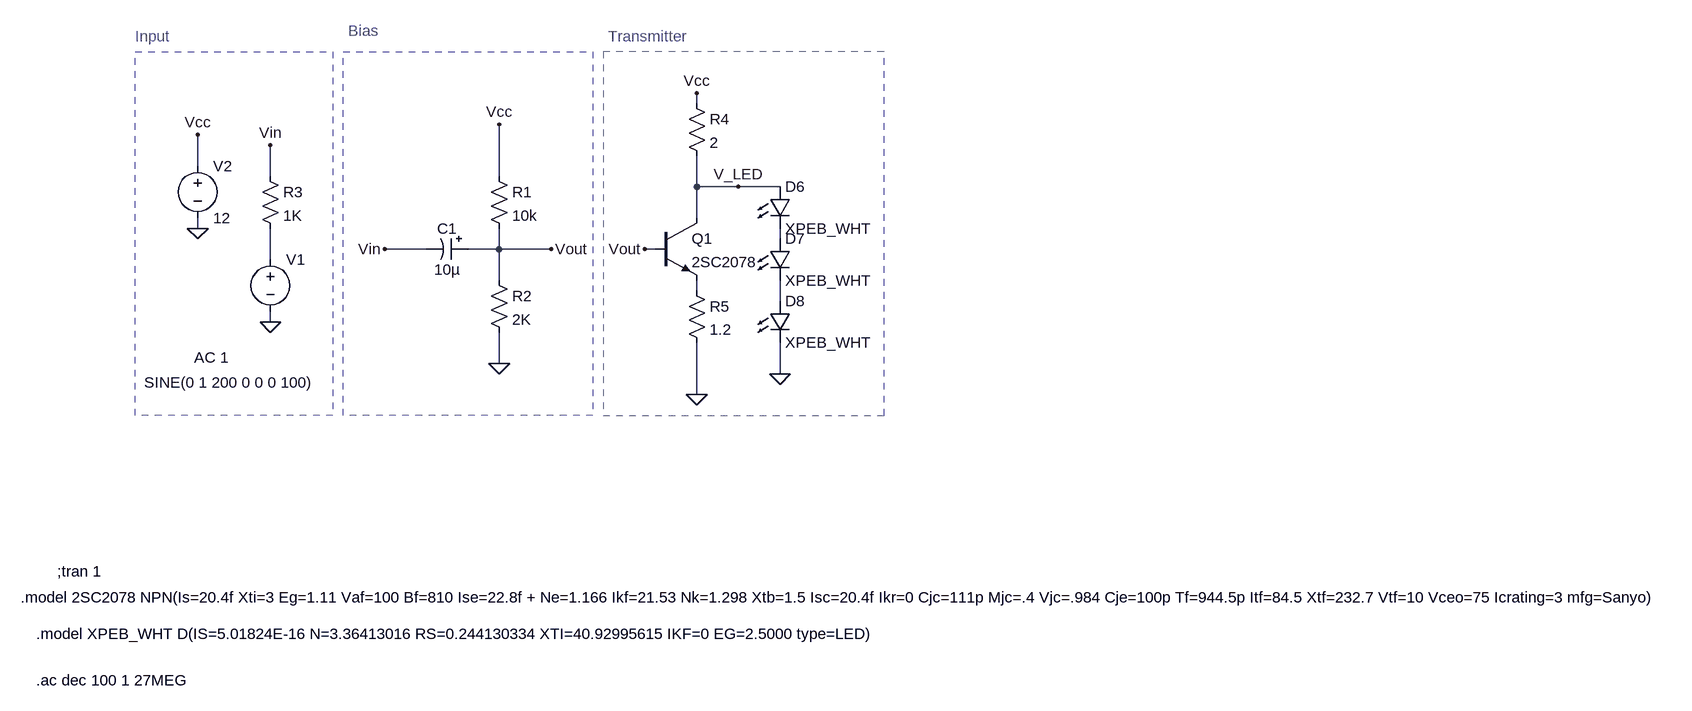
[diagram p0: schematic Transmitter Audio 2.asc]
Transmitter Audio 2.asc, the LTspice schematic file:
Version 4
SHEET 1 3692 824
WIRE 496 -80 496 -96
WIRE -272 16 -272 -32
WIRE -160 32 -160 -16
WIRE 192 32 192 -48
WIRE 496 48 496 0
WIRE 560 48 496 48
WIRE 624 48 560 48
WIRE 496 96 496 48
WIRE -272 112 -272 96
WIRE 624 128 624 112
WIRE 80 144 16 144
WIRE 192 144 192 112
WIRE 192 144 144 144
WIRE 272 144 192 144
WIRE 432 144 416 144
WIRE -160 160 -160 112
WIRE 192 192 192 144
WIRE 496 208 496 192
WIRE 624 224 624 192
WIRE -160 256 -160 240
WIRE 192 320 192 272
WIRE 624 336 624 288
WIRE 496 368 496 288
FLAG 16 144 Vin
FLAG 192 320 0
FLAG -160 256 0
FLAG -272 -32 Vcc
FLAG 192 -48 Vcc
FLAG 496 368 0
FLAG 496 -96 Vcc
FLAG -272 112 0
FLAG -160 -16 Vin
FLAG 416 144 Vout
FLAG 272 144 Vout
FLAG 624 336 0
FLAG 560 48 V_LED
DATAFLAG 192 176 ""
SYMBOL res 176 16 R0
SYMATTR InstName R1
SYMATTR Value 10k
SYMBOL res 176 176 R0
SYMATTR InstName R2
SYMATTR Value 2K
SYMBOL polcap 144 128 R90
WINDOW 0 0 32 VBottom 2
WINDOW 3 32 32 VTop 2
SYMATTR InstName C1
SYMATTR Value 10µ
SYMATTR Description Capacitor
SYMATTR Type cap
SYMATTR SpiceLine V=25 Irms=27m Rser=2.22517 Lser=834.91p mfg="Würth Elektronik" pn="865090440003 WCAP-ASLU 4x5,5" type="Al electrolytic"
SYMBOL voltage -160 144 R0
WINDOW 123 -117 167 Left 2
WINDOW 39 0 0 Left 0
WINDOW 3 -194 205 Left 2
SYMATTR Value2 AC 1
SYMATTR InstName V1
SYMATTR Value SINE(0 1 200 0 0 0 100)
SYMBOL LED 608 48 R0
SYMATTR InstName D6
SYMATTR Value XPEB_WHT
SYMBOL voltage -272 0 R0
WINDOW 123 0 0 Left 0
WINDOW 39 0 0 Left 0
SYMATTR InstName V2
SYMATTR Value 12
SYMBOL npn 432 96 R0
SYMATTR InstName Q1
SYMATTR Value 2SC2078
SYMBOL res 480 -96 R0
SYMATTR InstName R4
SYMATTR Value 2
SYMBOL res 480 192 R0
SYMATTR InstName R5
SYMATTR Value 1.2
SYMBOL LED 608 128 R0
SYMATTR InstName D7
SYMATTR Value XPEB_WHT
SYMBOL LED 608 224 R0
SYMATTR InstName D8
SYMATTR Value XPEB_WHT
SYMBOL res -176 16 R0
SYMATTR InstName R3
SYMATTR Value 1K
TEXT -40 -192 Left 2 ;Bias
TEXT 360 -184 Left 2 ;Transmitter
TEXT -368 -184 Left 2 ;Input
TEXT -520 736 Left 2 !.model XPEB_WHT D(IS=5.01824E-16 N=3.36413016 RS=0.244130334 XTI=40.92995615 IKF=0 EG=2.5000 type=LED)
TEXT -544 680 Left 2 !.model 2SC2078 NPN(Is=20.4f Xti=3 Eg=1.11 Vaf=100 Bf=810 Ise=22.8f + Ne=1.166 Ikf=21.53 Nk=1.298 Xtb=1.5 Isc=20.4f Ikr=0 Cjc=111p Mjc=.4 Vjc=.984 Cje=100p Tf=944.5p Itf=84.5 Xtf=232.7 Vtf=10 Vceo=75 Icrating=3 mfg=Sanyo)
TEXT -520 808 Left 2 !.ac dec 100 1 27MEG
TEXT -488 640 Left 2 !;tran 1
RECTANGLE Normal 336 400 -48 -160 2
RECTANGLE Normal -368 -160 -64 400 2
RECTANGLE Normal 784 -160 352 400 2

The netlist it stands for:
* Transmitter Audio 2.asc
R1 Vcc Vout 10k
R2 Vout 0 2K
C1 Vout Vin 10µ V=25 Irms=27m Rser=2.22517 Lser=834.91p mfg="Würth Elektronik" pn="865090440003 WCAP-ASLU 4x5,5" type="Al electrolytic"
V1 N002 0 SINE(0 1 200 0 0 0 100) AC 1
D6 V_LED N001 XPEB_WHT
V2 Vcc 0 12
Q1 V_LED Vout N003 0 2SC2078
R4 Vcc V_LED 2
R5 N003 0 1.2
D7 N001 N004 XPEB_WHT
D8 N004 0 XPEB_WHT
R3 Vin N002 1K
.model D D
.lib standard.dio
.model NPN NPN
.model PNP PNP
.lib standard.bjt
* Bias
* Transmitter
* Input
.model XPEB_WHT D(IS=5.01824E-16 N=3.36413016 RS=0.244130334 XTI=40.92995615 IKF=0 EG=2.5000 type=LED)
.model 2SC2078 NPN(Is=20.4f Xti=3 Eg=1.11 Vaf=100 Bf=810 Ise=22.8f + Ne=1.166 Ikf=21.53 Nk=1.298 Xtb=1.5 Isc=20.4f Ikr=0 Cjc=111p Mjc=.4 Vjc=.984 Cje=100p Tf=944.5p Itf=84.5 Xtf=232.7 Vtf=10 Vceo=75 Icrating=3 mfg=Sanyo)
.ac dec 100 1 27MEG
;tran 1
.backanno
.end